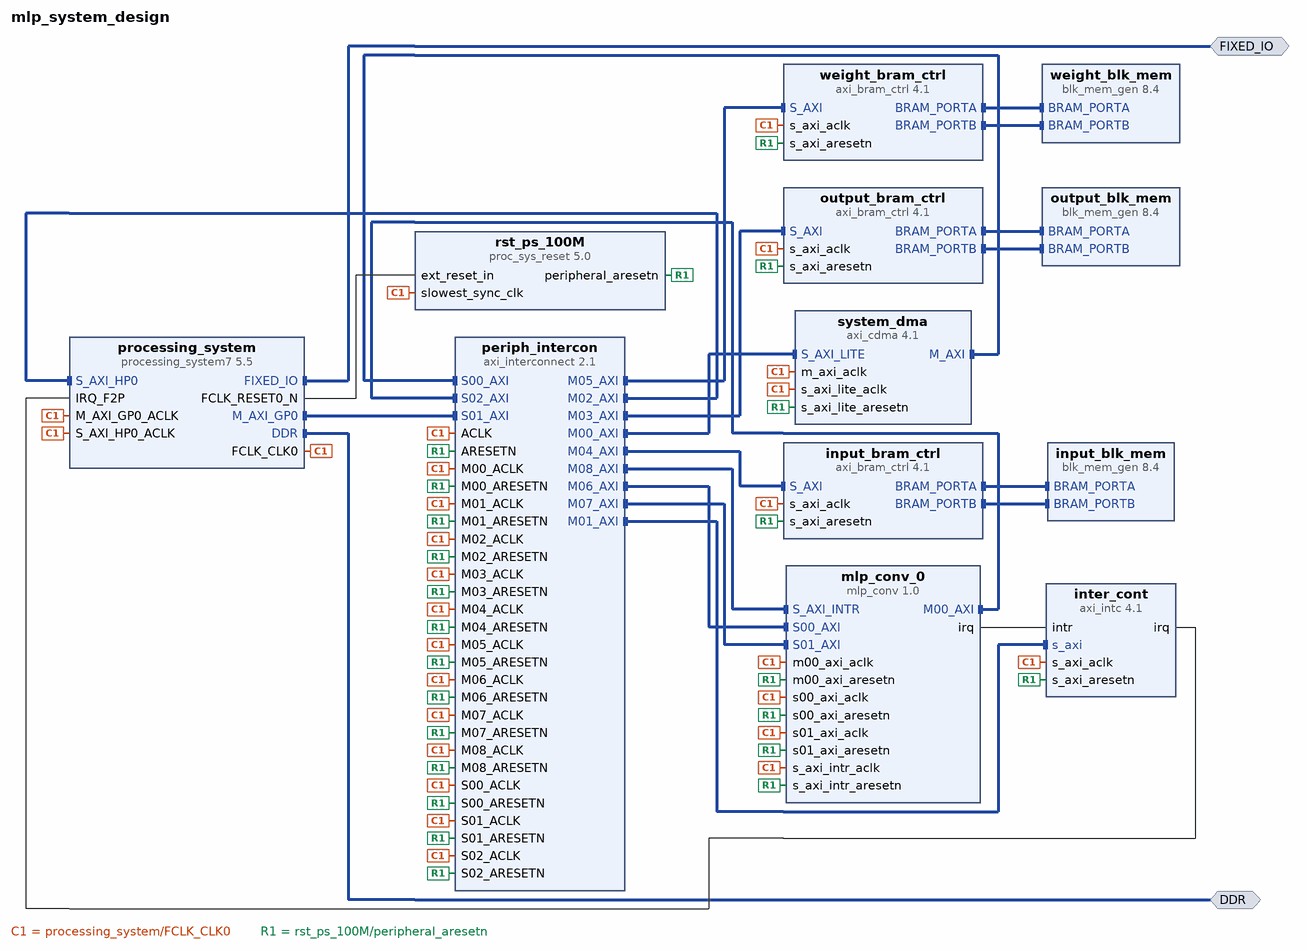
[diagram p0: block diagram of the top level]
# Vivado block design mlp_system_design, xc7z020clg484-1, Vivado 2020.1
create_bd_design mlp_system_design

create_bd_intf_port -mode Master -vlnv xilinx.com:interface:ddrx_rtl:1.0 DDR
create_bd_intf_port -mode Master -vlnv xilinx.com:display_processing_system7:fixedio_rtl:1.0 FIXED_IO

create_bd_cell -type ip -vlnv xilinx.com:ip:blk_mem_gen:8.4 input_blk_mem
set_property -dict [list \
  CONFIG.EN_SAFETY_CKT true \
  CONFIG.Enable_32bit_Address true \
  CONFIG.Enable_B Use_ENB_Pin \
  CONFIG.Memory_Type True_Dual_Port_RAM \
  CONFIG.Port_B_Clock 100 \
  CONFIG.Port_B_Enable_Rate 100 \
  CONFIG.Port_B_Write_Rate 50 \
  CONFIG.Register_PortA_Output_of_Memory_Primitives false \
  CONFIG.Register_PortB_Output_of_Memory_Primitives false \
  CONFIG.Use_RSTA_Pin true \
  CONFIG.Use_RSTB_Pin true \
  CONFIG.use_bram_block BRAM_Controller \
] [get_bd_cells input_blk_mem]
create_bd_cell -type ip -vlnv xilinx.com:ip:axi_bram_ctrl:4.1 input_bram_ctrl
set_property -dict {CONFIG.USE_ECC 0} [get_bd_cells input_bram_ctrl]
create_bd_cell -type ip -vlnv xilinx.com:ip:axi_intc:4.1 inter_cont
set_property -dict {CONFIG.C_IRQ_CONNECTION 1 CONFIG.C_NUM_SW_INTR 0} [get_bd_cells inter_cont]
create_bd_cell -type ip -vlnv xilinx.com:user:mlp_conv:1.0 mlp_conv_0
create_bd_cell -type ip -vlnv xilinx.com:ip:blk_mem_gen:8.4 output_blk_mem
set_property -dict [list \
  CONFIG.EN_SAFETY_CKT true \
  CONFIG.Enable_32bit_Address true \
  CONFIG.Enable_B Use_ENB_Pin \
  CONFIG.Memory_Type True_Dual_Port_RAM \
  CONFIG.Port_B_Clock 100 \
  CONFIG.Port_B_Enable_Rate 100 \
  CONFIG.Port_B_Write_Rate 50 \
  CONFIG.Register_PortA_Output_of_Memory_Primitives false \
  CONFIG.Register_PortB_Output_of_Memory_Primitives false \
  CONFIG.Use_RSTA_Pin true \
  CONFIG.Use_RSTB_Pin true \
  CONFIG.use_bram_block BRAM_Controller \
] [get_bd_cells output_blk_mem]
create_bd_cell -type ip -vlnv xilinx.com:ip:axi_bram_ctrl:4.1 output_bram_ctrl
set_property -dict {CONFIG.USE_ECC 0} [get_bd_cells output_bram_ctrl]
create_bd_cell -type ip -vlnv xilinx.com:ip:axi_interconnect:2.1 periph_intercon
set_property -dict {CONFIG.NUM_MI 9 CONFIG.NUM_SI 3} [get_bd_cells periph_intercon]
create_bd_cell -type ip -vlnv xilinx.com:ip:processing_system7:5.5 processing_system
set_property -dict [list \
  CONFIG.PCW_APU_PERIPHERAL_FREQMHZ 666.666667 \
  CONFIG.PCW_ENET0_ENET0_IO {MIO 16 .. 27} \
  CONFIG.PCW_ENET0_GRP_MDIO_ENABLE 1 \
  CONFIG.PCW_ENET0_GRP_MDIO_IO {MIO 52 .. 53} \
  CONFIG.PCW_ENET0_PERIPHERAL_ENABLE 1 \
  CONFIG.PCW_ENET0_RESET_ENABLE 0 \
  CONFIG.PCW_ENET_RESET_ENABLE 1 \
  CONFIG.PCW_ENET_RESET_SELECT {Share reset pin} \
  CONFIG.PCW_FPGA0_PERIPHERAL_FREQMHZ 100.000000 \
  CONFIG.PCW_FPGA1_PERIPHERAL_FREQMHZ 150.000000 \
  CONFIG.PCW_GPIO_MIO_GPIO_ENABLE 1 \
  CONFIG.PCW_GPIO_MIO_GPIO_IO MIO \
  CONFIG.PCW_I2C_RESET_ENABLE 1 \
  CONFIG.PCW_IRQ_F2P_INTR 1 \
  CONFIG.PCW_PRESET_BANK1_VOLTAGE {LVCMOS 1.8V} \
  CONFIG.PCW_QSPI_GRP_SINGLE_SS_ENABLE 1 \
  CONFIG.PCW_QSPI_GRP_SINGLE_SS_IO {MIO 1 .. 6} \
  CONFIG.PCW_QSPI_PERIPHERAL_ENABLE 1 \
  CONFIG.PCW_QSPI_QSPI_IO {MIO 1 .. 6} \
  CONFIG.PCW_SD0_GRP_CD_ENABLE 1 \
  CONFIG.PCW_SD0_GRP_CD_IO {MIO 47} \
  CONFIG.PCW_SD0_GRP_WP_ENABLE 1 \
  CONFIG.PCW_SD0_GRP_WP_IO {MIO 46} \
  CONFIG.PCW_SD0_PERIPHERAL_ENABLE 1 \
  CONFIG.PCW_SD0_SD0_IO {MIO 40 .. 45} \
  CONFIG.PCW_SDIO_PERIPHERAL_FREQMHZ 50 \
  CONFIG.PCW_SINGLE_QSPI_DATA_MODE x4 \
  CONFIG.PCW_TTC0_PERIPHERAL_ENABLE 1 \
  CONFIG.PCW_TTC0_TTC0_IO EMIO \
  CONFIG.PCW_UART1_PERIPHERAL_ENABLE 1 \
  CONFIG.PCW_UART1_UART1_IO {MIO 48 .. 49} \
  CONFIG.PCW_UART_PERIPHERAL_FREQMHZ 50 \
  CONFIG.PCW_UIPARAM_DDR_FREQ_MHZ 533.333313 \
  CONFIG.PCW_UIPARAM_DDR_PARTNO {MT41J128M16 HA-15E} \
  CONFIG.PCW_UIPARAM_GENERATE_SUMMARY NONE \
  CONFIG.PCW_USB0_PERIPHERAL_ENABLE 1 \
  CONFIG.PCW_USB0_RESET_ENABLE 0 \
  CONFIG.PCW_USB0_USB0_IO {MIO 28 .. 39} \
  CONFIG.PCW_USB_RESET_ENABLE 1 \
  CONFIG.PCW_USB_RESET_SELECT {Share reset pin} \
  CONFIG.PCW_USE_DEBUG 1 \
  CONFIG.PCW_USE_FABRIC_INTERRUPT 1 \
  CONFIG.PCW_USE_S_AXI_HP0 1 \
  CONFIG.preset ZedBoard \
] [get_bd_cells processing_system]
# 225 more settings of processing_system are not shown: defaults, MIO pin electricals, DDR timing, and values the tool derives
create_bd_cell -type ip -vlnv xilinx.com:ip:proc_sys_reset:5.0 rst_ps_100M
create_bd_cell -type ip -vlnv xilinx.com:ip:axi_cdma:4.1 system_dma
set_property -dict {CONFIG.C_INCLUDE_DRE 1 CONFIG.C_INCLUDE_SF 1 CONFIG.C_INCLUDE_SG 0} [get_bd_cells system_dma]
create_bd_cell -type ip -vlnv xilinx.com:ip:blk_mem_gen:8.4 weight_blk_mem
set_property -dict [list \
  CONFIG.EN_SAFETY_CKT true \
  CONFIG.Enable_32bit_Address true \
  CONFIG.Enable_B Use_ENB_Pin \
  CONFIG.Memory_Type True_Dual_Port_RAM \
  CONFIG.Port_B_Clock 100 \
  CONFIG.Port_B_Enable_Rate 100 \
  CONFIG.Port_B_Write_Rate 50 \
  CONFIG.Register_PortA_Output_of_Memory_Primitives false \
  CONFIG.Register_PortB_Output_of_Memory_Primitives false \
  CONFIG.Use_RSTA_Pin true \
  CONFIG.Use_RSTB_Pin true \
  CONFIG.use_bram_block BRAM_Controller \
] [get_bd_cells weight_blk_mem]
create_bd_cell -type ip -vlnv xilinx.com:ip:axi_bram_ctrl:4.1 weight_bram_ctrl
set_property -dict {CONFIG.USE_ECC 0} [get_bd_cells weight_bram_ctrl]

# ---- connections ----

connect_bd_intf_net [get_bd_intf_pins mlp_conv_0/S_AXI_INTR] [get_bd_intf_pins periph_intercon/M08_AXI]
connect_bd_intf_net -intf_net axi_bram_ctrl_0_BRAM_PORTA [get_bd_intf_pins output_blk_mem/BRAM_PORTA] [get_bd_intf_pins output_bram_ctrl/BRAM_PORTA]
connect_bd_intf_net -intf_net axi_bram_ctrl_0_BRAM_PORTB [get_bd_intf_pins output_blk_mem/BRAM_PORTB] [get_bd_intf_pins output_bram_ctrl/BRAM_PORTB]
connect_bd_intf_net -intf_net axi_bram_ctrl_1_BRAM_PORTA [get_bd_intf_pins input_blk_mem/BRAM_PORTA] [get_bd_intf_pins input_bram_ctrl/BRAM_PORTA]
connect_bd_intf_net -intf_net axi_bram_ctrl_1_BRAM_PORTB [get_bd_intf_pins input_blk_mem/BRAM_PORTB] [get_bd_intf_pins input_bram_ctrl/BRAM_PORTB]
connect_bd_intf_net -intf_net axi_bram_ctrl_2_BRAM_PORTA [get_bd_intf_pins weight_blk_mem/BRAM_PORTA] [get_bd_intf_pins weight_bram_ctrl/BRAM_PORTA]
connect_bd_intf_net -intf_net axi_bram_ctrl_2_BRAM_PORTB [get_bd_intf_pins weight_blk_mem/BRAM_PORTB] [get_bd_intf_pins weight_bram_ctrl/BRAM_PORTB]
connect_bd_intf_net -intf_net axi_cdma_0_M_AXI [get_bd_intf_pins periph_intercon/S00_AXI] [get_bd_intf_pins system_dma/M_AXI]
connect_bd_intf_net -intf_net axi_interconnect_0_M00_AXI [get_bd_intf_pins periph_intercon/M00_AXI] [get_bd_intf_pins system_dma/S_AXI_LITE]
connect_bd_intf_net [get_bd_intf_pins mlp_conv_0/M00_AXI] [get_bd_intf_pins periph_intercon/S02_AXI]
connect_bd_intf_net [get_bd_intf_pins inter_cont/s_axi] [get_bd_intf_pins periph_intercon/M01_AXI]
connect_bd_intf_net [get_bd_intf_pins periph_intercon/M02_AXI] [get_bd_intf_pins processing_system/S_AXI_HP0]
connect_bd_intf_net [get_bd_intf_pins output_bram_ctrl/S_AXI] [get_bd_intf_pins periph_intercon/M03_AXI]
connect_bd_intf_net [get_bd_intf_pins input_bram_ctrl/S_AXI] [get_bd_intf_pins periph_intercon/M04_AXI]
connect_bd_intf_net [get_bd_intf_pins periph_intercon/M05_AXI] [get_bd_intf_pins weight_bram_ctrl/S_AXI]
connect_bd_intf_net -intf_net processing_system7_0_M_AXI_GP0 [get_bd_intf_pins periph_intercon/S01_AXI] [get_bd_intf_pins processing_system/M_AXI_GP0]
connect_bd_intf_net -intf_net processing_system7_0_FIXED_IO [get_bd_intf_ports FIXED_IO] [get_bd_intf_pins processing_system/FIXED_IO]
connect_bd_intf_net -intf_net processing_system7_0_DDR [get_bd_intf_ports DDR] [get_bd_intf_pins processing_system/DDR]
connect_bd_intf_net [get_bd_intf_pins mlp_conv_0/S00_AXI] [get_bd_intf_pins periph_intercon/M06_AXI]
connect_bd_intf_net [get_bd_intf_pins mlp_conv_0/S01_AXI] [get_bd_intf_pins periph_intercon/M07_AXI]
connect_bd_net -net axi_intc_0_irq [get_bd_pins inter_cont/irq] [get_bd_pins processing_system/IRQ_F2P]
connect_bd_net [get_bd_pins mlp_conv_0/irq] [get_bd_pins inter_cont/intr]
connect_bd_net -net processing_system7_0_FCLK_CLK0 [get_bd_pins processing_system/FCLK_CLK0] \
  [get_bd_pins input_bram_ctrl/s_axi_aclk] [get_bd_pins inter_cont/s_axi_aclk] [get_bd_pins mlp_conv_0/m00_axi_aclk] \
  [get_bd_pins mlp_conv_0/s00_axi_aclk] [get_bd_pins mlp_conv_0/s01_axi_aclk] [get_bd_pins mlp_conv_0/s_axi_intr_aclk] \
  [get_bd_pins output_bram_ctrl/s_axi_aclk] [get_bd_pins periph_intercon/ACLK] [get_bd_pins periph_intercon/M00_ACLK] \
  [get_bd_pins periph_intercon/M01_ACLK] [get_bd_pins periph_intercon/M02_ACLK] [get_bd_pins periph_intercon/M03_ACLK] \
  [get_bd_pins periph_intercon/M04_ACLK] [get_bd_pins periph_intercon/M05_ACLK] [get_bd_pins periph_intercon/M06_ACLK] \
  [get_bd_pins periph_intercon/M07_ACLK] [get_bd_pins periph_intercon/M08_ACLK] [get_bd_pins periph_intercon/S00_ACLK] \
  [get_bd_pins periph_intercon/S01_ACLK] [get_bd_pins periph_intercon/S02_ACLK] \
  [get_bd_pins processing_system/M_AXI_GP0_ACLK] [get_bd_pins processing_system/S_AXI_HP0_ACLK] \
  [get_bd_pins rst_ps_100M/slowest_sync_clk] [get_bd_pins system_dma/m_axi_aclk] [get_bd_pins system_dma/s_axi_lite_aclk] \
  [get_bd_pins weight_bram_ctrl/s_axi_aclk]
connect_bd_net -net processing_system7_0_FCLK_RESET0_N [get_bd_pins processing_system/FCLK_RESET0_N] [get_bd_pins rst_ps_100M/ext_reset_in]
connect_bd_net -net rst_ps7_0_100M_peripheral_aresetn [get_bd_pins rst_ps_100M/peripheral_aresetn] \
  [get_bd_pins input_bram_ctrl/s_axi_aresetn] [get_bd_pins inter_cont/s_axi_aresetn] [get_bd_pins mlp_conv_0/m00_axi_aresetn] \
  [get_bd_pins mlp_conv_0/s00_axi_aresetn] [get_bd_pins mlp_conv_0/s01_axi_aresetn] \
  [get_bd_pins mlp_conv_0/s_axi_intr_aresetn] [get_bd_pins output_bram_ctrl/s_axi_aresetn] \
  [get_bd_pins periph_intercon/ARESETN] [get_bd_pins periph_intercon/M00_ARESETN] [get_bd_pins periph_intercon/M01_ARESETN] \
  [get_bd_pins periph_intercon/M02_ARESETN] [get_bd_pins periph_intercon/M03_ARESETN] \
  [get_bd_pins periph_intercon/M04_ARESETN] [get_bd_pins periph_intercon/M05_ARESETN] \
  [get_bd_pins periph_intercon/M06_ARESETN] [get_bd_pins periph_intercon/M07_ARESETN] \
  [get_bd_pins periph_intercon/M08_ARESETN] [get_bd_pins periph_intercon/S00_ARESETN] \
  [get_bd_pins periph_intercon/S01_ARESETN] [get_bd_pins periph_intercon/S02_ARESETN] \
  [get_bd_pins system_dma/s_axi_lite_aresetn] [get_bd_pins weight_bram_ctrl/s_axi_aresetn]
set_property HDL_ATTRIBUTE.BMM_INFO_ADDRESS_SPACE {byte  0x42000000 32 > mlp_system_design input_blk_mem} [get_bd_cells input_bram_ctrl]
set_property HDL_ATTRIBUTE.KEEP_HIERARCHY yes [get_bd_cells input_bram_ctrl]
set_property HDL_ATTRIBUTE.BMM_INFO_ADDRESS_SPACE {byte  0x40000000 32 > mlp_system_design output_blk_mem} [get_bd_cells output_bram_ctrl]
set_property HDL_ATTRIBUTE.KEEP_HIERARCHY yes [get_bd_cells output_bram_ctrl]
set_property HDL_ATTRIBUTE.BMM_INFO_PROCESSOR {arm > mlp_system_design output_bram_ctrl mlp_system_design input_bram_ctrl mlp_system_design weight_bram_ctrl} [get_bd_cells processing_system]
set_property HDL_ATTRIBUTE.KEEP_HIERARCHY yes [get_bd_cells processing_system]
set_property HDL_ATTRIBUTE.BMM_INFO_ADDRESS_SPACE {byte  0x44000000 32 > mlp_system_design weight_blk_mem} [get_bd_cells weight_bram_ctrl]
set_property HDL_ATTRIBUTE.KEEP_HIERARCHY yes [get_bd_cells weight_bram_ctrl]

# ---- address map ----
assign_bd_address -offset 0x00000000 -range 512M -target_address_space [get_bd_addr_spaces mlp_conv_0/M00_AXI] [get_bd_addr_segs processing_system/S_AXI_HP0/HP0_DDR_LOWOCM]
assign_bd_address -offset 0x40000000 -range 64K -target_address_space [get_bd_addr_spaces mlp_conv_0/M00_AXI] [get_bd_addr_segs output_bram_ctrl/S_AXI/Mem0]
assign_bd_address -offset 0x41800000 -range 64K -target_address_space [get_bd_addr_spaces mlp_conv_0/M00_AXI] [get_bd_addr_segs inter_cont/S_AXI/Reg]
assign_bd_address -offset 0x42000000 -range 64K -target_address_space [get_bd_addr_spaces mlp_conv_0/M00_AXI] [get_bd_addr_segs input_bram_ctrl/S_AXI/Mem0]
assign_bd_address -offset 0x43C00000 -range 64K -target_address_space [get_bd_addr_spaces mlp_conv_0/M00_AXI] [get_bd_addr_segs mlp_conv_0/S00_AXI/S00_AXI_reg]
assign_bd_address -offset 0x43C10000 -range 64K -target_address_space [get_bd_addr_spaces mlp_conv_0/M00_AXI] [get_bd_addr_segs mlp_conv_0/S_AXI_INTR/S_AXI_INTR_reg]
assign_bd_address -offset 0x44000000 -range 64K -target_address_space [get_bd_addr_spaces mlp_conv_0/M00_AXI] [get_bd_addr_segs weight_bram_ctrl/S_AXI/Mem0]
assign_bd_address -offset 0x7AA00000 -range 64K -target_address_space [get_bd_addr_spaces mlp_conv_0/M00_AXI] [get_bd_addr_segs mlp_conv_0/S01_AXI/S01_AXI_mem]
assign_bd_address -offset 0x7E210000 -range 64K -target_address_space [get_bd_addr_spaces mlp_conv_0/M00_AXI] [get_bd_addr_segs system_dma/S_AXI_LITE/Reg]
assign_bd_address -offset 0x40000000 -range 64K -target_address_space [get_bd_addr_spaces processing_system/Data] [get_bd_addr_segs output_bram_ctrl/S_AXI/Mem0]
assign_bd_address -offset 0x41800000 -range 64K -target_address_space [get_bd_addr_spaces processing_system/Data] [get_bd_addr_segs inter_cont/S_AXI/Reg]
assign_bd_address -offset 0x42000000 -range 64K -target_address_space [get_bd_addr_spaces processing_system/Data] [get_bd_addr_segs input_bram_ctrl/S_AXI/Mem0]
assign_bd_address -offset 0x43C00000 -range 64K -target_address_space [get_bd_addr_spaces processing_system/Data] [get_bd_addr_segs mlp_conv_0/S00_AXI/S00_AXI_reg]
assign_bd_address -offset 0x43C10000 -range 64K -target_address_space [get_bd_addr_spaces processing_system/Data] [get_bd_addr_segs mlp_conv_0/S_AXI_INTR/S_AXI_INTR_reg]
assign_bd_address -offset 0x44000000 -range 64K -target_address_space [get_bd_addr_spaces processing_system/Data] [get_bd_addr_segs weight_bram_ctrl/S_AXI/Mem0]
assign_bd_address -offset 0x7AA00000 -range 64K -target_address_space [get_bd_addr_spaces processing_system/Data] [get_bd_addr_segs mlp_conv_0/S01_AXI/S01_AXI_mem]
assign_bd_address -offset 0x7E210000 -range 64K -target_address_space [get_bd_addr_spaces processing_system/Data] [get_bd_addr_segs system_dma/S_AXI_LITE/Reg]
exclude_bd_addr_seg -offset 0x00000000 -range 1 -target_address_space [get_bd_addr_spaces processing_system/Data] [get_bd_addr_segs processing_system/S_AXI_HP0/HP0_DDR_LOWOCM]
assign_bd_address -offset 0x00000000 -range 512M -target_address_space [get_bd_addr_spaces system_dma/Data] [get_bd_addr_segs processing_system/S_AXI_HP0/HP0_DDR_LOWOCM]
assign_bd_address -offset 0x40000000 -range 64K -target_address_space [get_bd_addr_spaces system_dma/Data] [get_bd_addr_segs output_bram_ctrl/S_AXI/Mem0]
assign_bd_address -offset 0x42000000 -range 64K -target_address_space [get_bd_addr_spaces system_dma/Data] [get_bd_addr_segs input_bram_ctrl/S_AXI/Mem0]
assign_bd_address -offset 0x44000000 -range 64K -target_address_space [get_bd_addr_spaces system_dma/Data] [get_bd_addr_segs weight_bram_ctrl/S_AXI/Mem0]
assign_bd_address -offset 0x7AA00000 -range 64K -target_address_space [get_bd_addr_spaces system_dma/Data] [get_bd_addr_segs mlp_conv_0/S01_AXI/S01_AXI_mem]
exclude_bd_addr_seg -offset 0x41800000 -range 64K -target_address_space [get_bd_addr_spaces system_dma/Data] [get_bd_addr_segs inter_cont/S_AXI/Reg]
exclude_bd_addr_seg -offset 0x43C00000 -range 64K -target_address_space [get_bd_addr_spaces system_dma/Data] [get_bd_addr_segs mlp_conv_0/S00_AXI/S00_AXI_reg]
exclude_bd_addr_seg -offset 0x43C10000 -range 64K -target_address_space [get_bd_addr_spaces system_dma/Data] [get_bd_addr_segs mlp_conv_0/S_AXI_INTR/S_AXI_INTR_reg]
exclude_bd_addr_seg -offset 0x7E210000 -range 64K -target_address_space [get_bd_addr_spaces system_dma/Data] [get_bd_addr_segs system_dma/S_AXI_LITE/Reg]

validate_bd_design
save_bd_design
